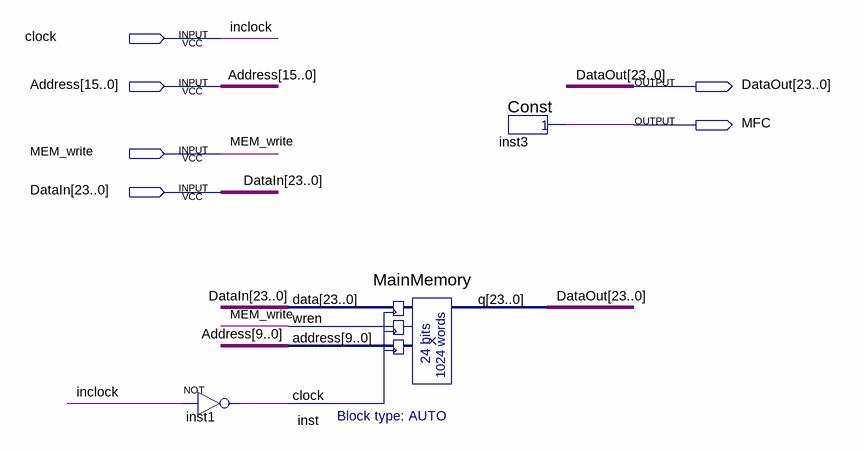
[diagram p0: schematic sheet]
// Quartus schematic MemoryInterface.bdf as structural Verilog: 3 symbols, 6 pins
module MemoryInterface (
  input  clock,
  input  [15:0] Address,
  input  MEM_write,
  input  [23:0] DataIn,
  output [23:0] DataOut,
  output MFC
);

  wire inst1_out;

  not inst1 (inst1_out, clock);
  MainMemory inst (.data(DataIn), .wren(MEM_write), .address(Address[9:0]), .clock(inst1_out), .q(DataOut));
  Const inst3 (.result(MFC));

  // Other names for the same wires on the sheet: inclock = clock
endmodule
